# EasyEDA schematic SCH_DA2_fix_2023-07-17.json
TITLE: Mq135; REV: 1.0; Date: 2023-06-28; Sheet: 1/1; Company: Your Company
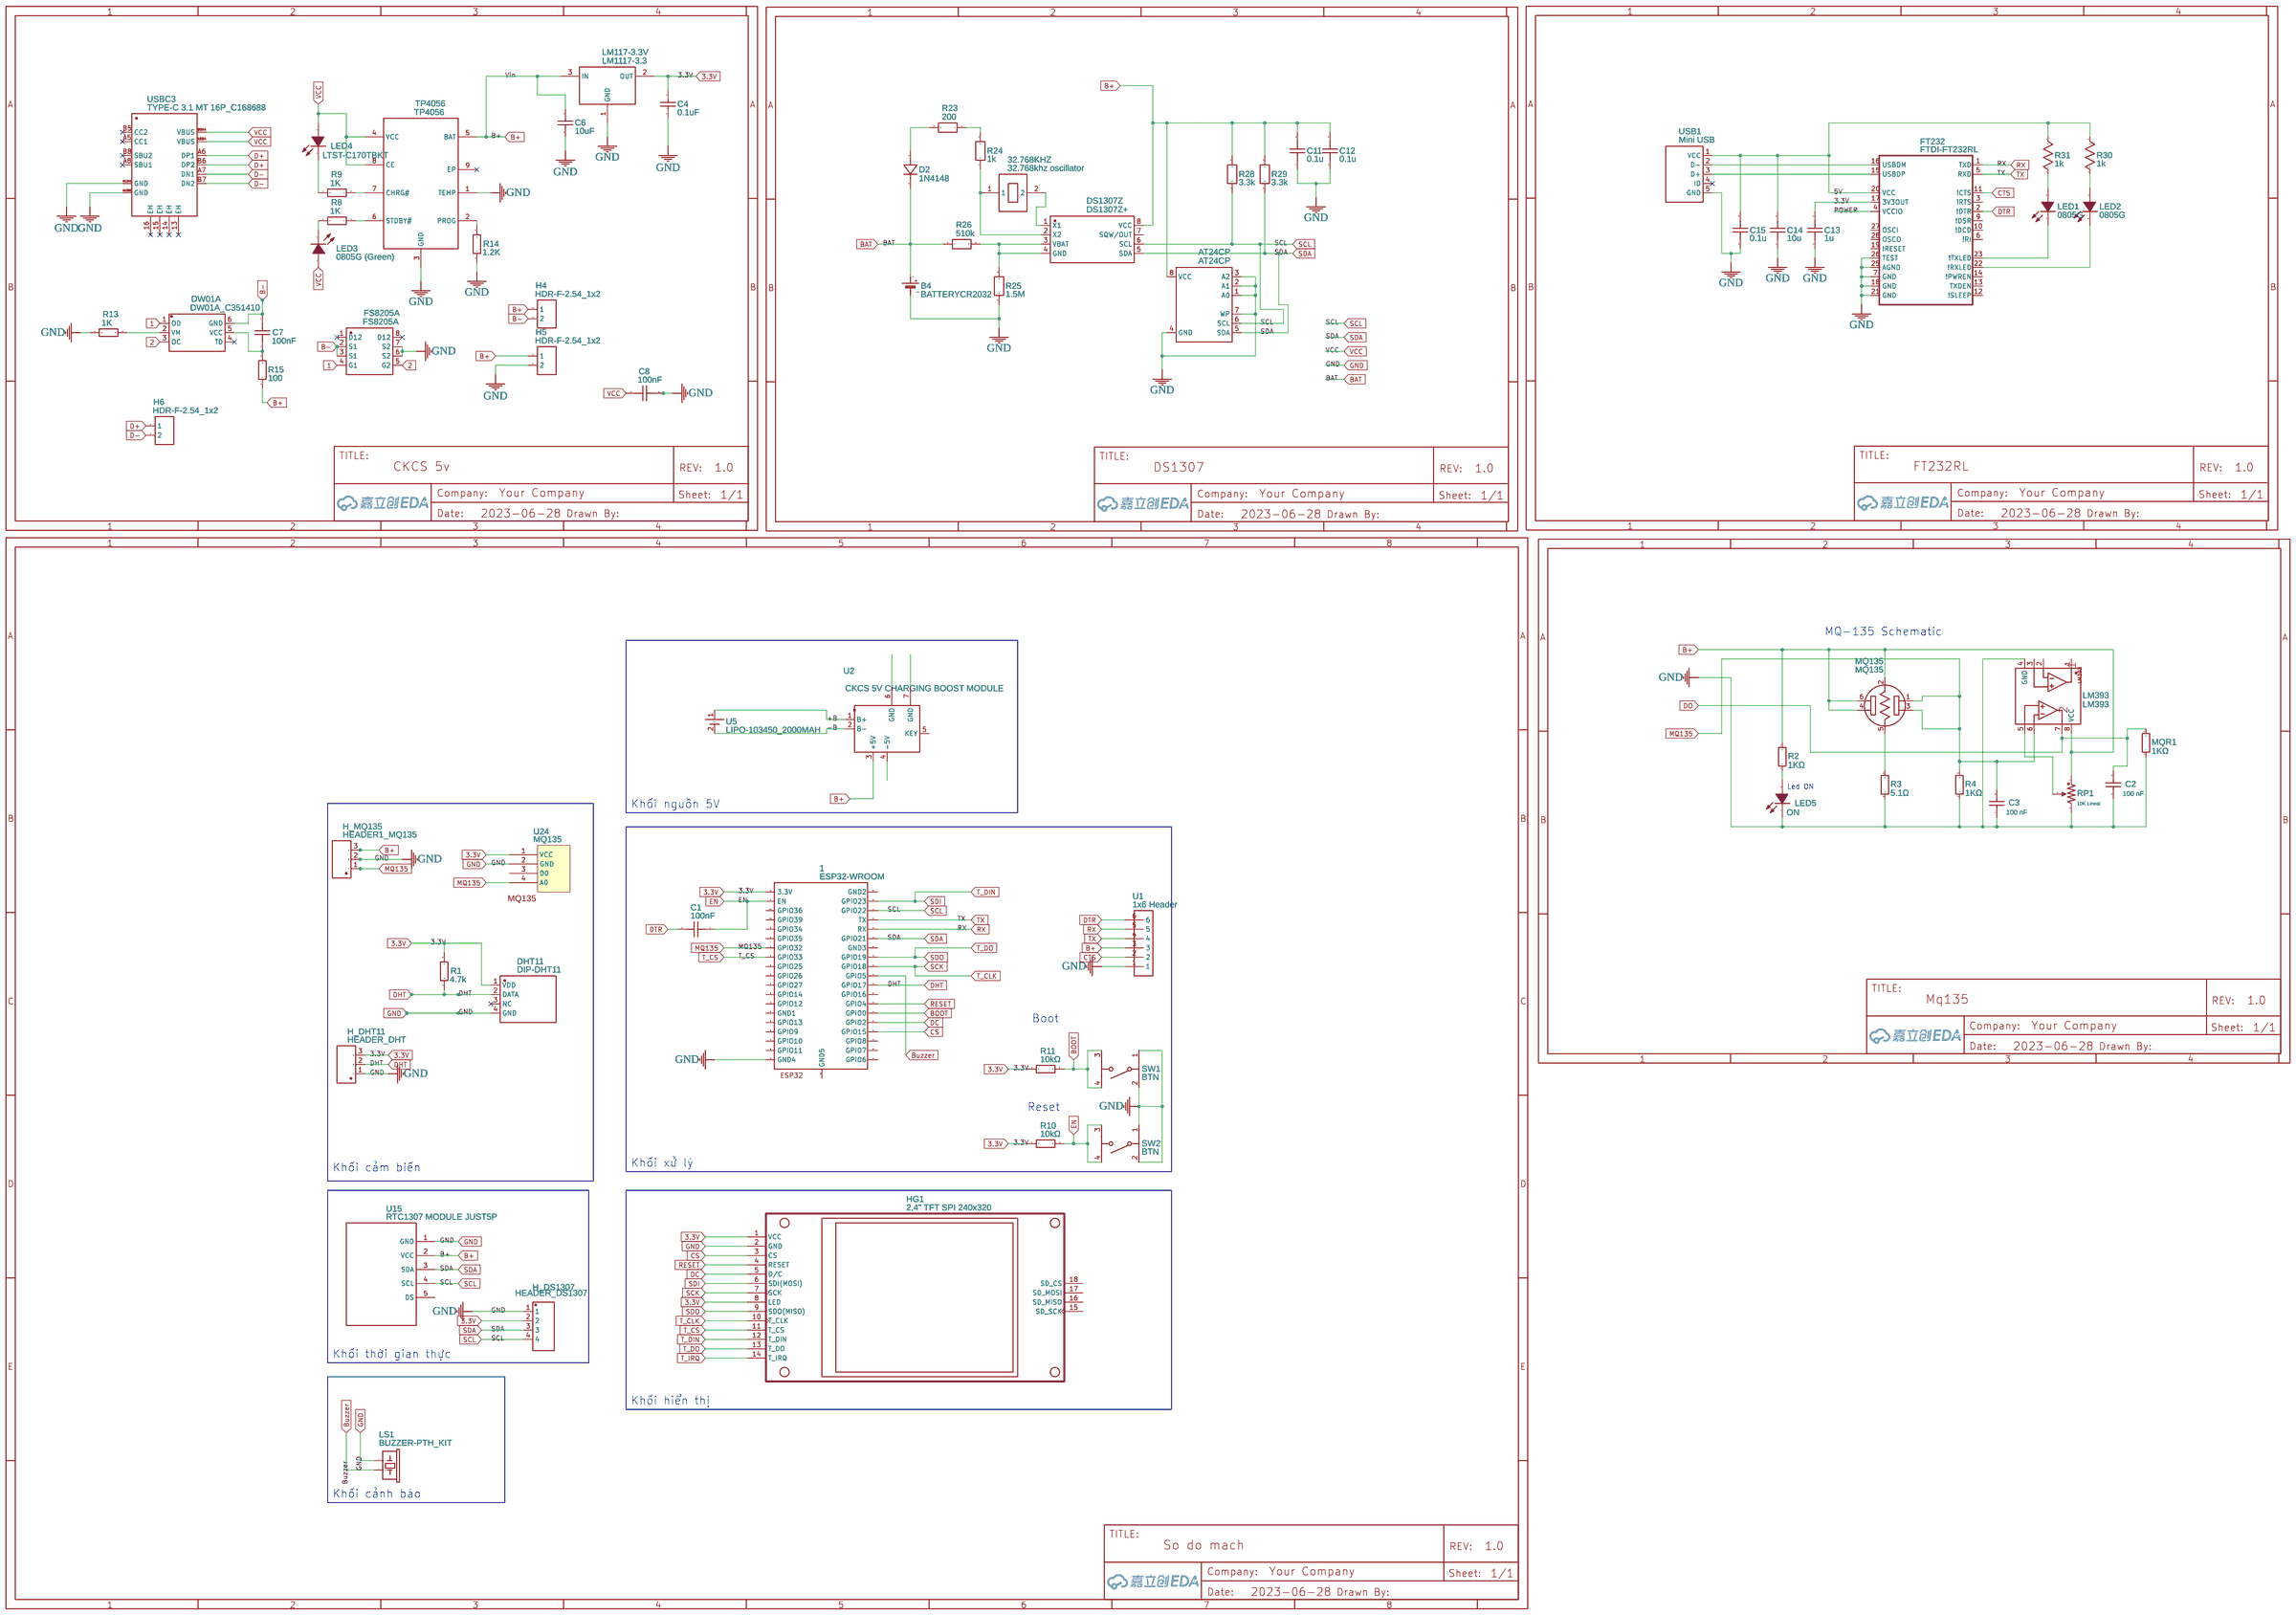
[diagram p0: schematic sheet]

## Parts
1  ESP32-WROOM  [ESP32-WROOM]
32.768KHZ  32.768khz oscillator  [32.768KHZ OSCILLATOR]
AT24CP  AT24CP  [DIL08]
B4  BATTERYCR2032  [CR2032_4U_15728]
C1  100nF  [C0805]
C2  100 nF  [C0805]
C3  100 nF  [C0805]
C4  0.1uF  [C0805]
C6  10uF  [C0805]
C7  100nF  [C0805]
C8  100nF  [C0805]
C11  0.1u  [C0805]
C12  0.1u  [C0805]
C13  1u  [C0805]
C14  10u  [C0805]
C15  0.1u  [C0805]
D2  1N4148  [SOD-323_L1.6-W1.3-LS2.7-RD]
DHT11  DIP-DHT11  [DIP-DHT11]
DS1307Z  DS1307Z+  [SOIC-8_L5.0-W4.0-P1.27-LS6.0-BL]
DW01A  DW01A_C351410  [SOT-23-6_L2.9-W1.6-P0.95-LS2.8-BL]
FS8205A  FS8205A  [TSSOP-8_L4.4-W3.0-P0.65-LS6.4-BL-2]
FT232  FTDI-FT232RL  [SSOP28]
H4  HDR-F-2.54_1x2  [HDR-F-2.54_1X2]
H5  HDR-F-2.54_1x2  [HDR-F-2.54_1X2]
H6  HDR-F-2.54_1x2  [HDR-F-2.54_1X2]
H_DHT11  HEADER_DHT  [HEADER1X3]
H_DS1307  HEADER_DS1307  [HEADER - HEADER-FEMALE-2.54_1X4]
H_MQ135  HEADER1_MQ135  [HEADER1X3]
HG1  2,4" TFT SPI 240x320  [2.4_TFT_TS]
LED1  0805G  [LED0805-RD_GREEN]
LED2  0805G  [LED0805-RD_GREEN]
LED3  0805G (Green)  [LED0805-RD_GREEN]
LED4  LTST-C170TBKT  [LED0805-RD_BLUE]
LED5  ON  [LED0805-RD_BLUE]
LM117-3.3V  LM1117-3.3  [LM1117-3.3 UP]
LM393  LM393  [MSOP-8_L3.0-W3.0-P0.65-LS5.0-BL]
LS1  BUZZER-PTH_KIT  [BUZZER-12MM-KIT]
MQ135  MQ135  [MQ135_METAL_CAP]
MQR1  1KΩ  [R0805]
R1  4.7k  [R0805]
R2  1KΩ  [R0805]
R3  5.1Ω  [R0805]
R4  1KΩ  [R0805]
R8  1K  [R0805]
R9  1K  [R0805]
R10  10kΩ  [R0805]
R11  10kΩ  [R0805]
R13  1K  [R0805]
R14  1.2K  [R0805]
R15  100  [R0805]
R23  200  [R0805]
R24  1k  [R0805]
R25  1.5M  [R0805]
R26  510k  [R0805]
R28  3.3k  [R0805]
R29  3.3k  [R0805]
R30  1k  [R0805]
R31  1k  [R0805]
RP1  10K Lineal  [RES-ADJ-TH_3386P]
SW1  BTN  [SW-TH_4P-L6.0-W6.0-P4.50-LS6.1]
SW2  BTN  [SW-TH_4P-L6.0-W6.0-P4.50-LS6.1]
TP4056  TP4056  [ESOP-8_L4.9-W3.9-P1.27-LS6.0-BL-EP]
U1  1x6 Header  [1X6 HEADER]
U2  CKCS 5V CHARGING BOOST MODULE  [CKCS 5V CHARGING MODULE]
U5  LIPO-103450_2000MAH  [LIPO-103450_2000MAH]
U15  RTC1307 MODULE JUST5P  [RTC1307 MODULE]
U24  MQ135  [MQ135]
USB1  Mini USB  [MINI-USB-SMD_MINI-5PTP]
USBC3  TYPE-C 3.1 MT 16P_C168688  [USB-C-SMD_TYPE-C-USB-4]

## Library data of the parts
1 = ESP32-WROOM: Contributor: eagleone
32.768KHZ = 32.768khz oscillator: Contributor: pattykarigi96
AT24CP = AT24CP: 2-wire serial EEPROM
B4 = BATTERYCR2032: Contributor: farmerjoe0606
C1 C7 C8 = C0805B104M500NT: Supplier: LCSC; Supplier Part: C515949; Manufacturer: 火炬; Contributor: LCSC; JLCPCB Part Class: Extended Part
C2 C3 = Cap.: Supplier: LCSC; Manufacturer: LCSC; Manufacturer Part: 0.1UF(104) +-20% 63v; Supplier Part: C19355; Contributor: Educaporale
C4 C6 = CC0805KKX5R6BB106: Supplier: LCSC; Manufacturer: YAGEO; Supplier Part: C89832; JLCPCB Part Class: Extended Part
C11 C12 = C_0603_US: Contributor: LCEDA_Lib
C13-C15 = Cap_1206_US: Manufacturer Part: ?
D2 = 1N4148WSG_C2904852: Supplier: LCSC; Supplier Part: C2904852; Manufacturer: SHIKUES(时科); Manufacturer Part: 1N4148WSG; JLCPCB Part Class: Extended Part; Contributor: lcsc
DHT11 = DIP-DHT11: Supplier: LCSC; Manufacturer: AOSONG; Contributor: LCSC; Supplier Part: C117051
DS1307Z = DS1307Z+: Supplier: LCSC; Supplier Part: C1520446; Manufacturer: MAXIM(美信); Contributor: LCSC; JLCPCB Part Class: Extended Part
DW01A = DW01A_C351410: Supplier: LCSC; Supplier Part: C351410; Manufacturer: PUOLOP; Contributor: LCSC; JLCPCB Part Class: Extended Part
FS8205A = FS8205A: Supplier: LCSC; Manufacturer: FORTUNE; Supplier Part: C16052; JLCPCB Part Class: Basic Part
FT232 = -: Contributor: mrsunny; Manufacturer Part: ?
H4-H6 = HDR-F-2.54_1x2: Supplier Part: C49661; Supplier: LCSC; Contributor: LCEDA_Lib
H_DHT11 = HEADER1X3: Contributor: Nathan Milligan
H_DS1307 = HEADER 1X4P COPY COPY: Contributor: trananhkha2406; Supplier: Sparkfun
H_MQ135 = HEADER1X3: Contributor: Nathan Milligan; Package Display: No
HG1 = 2,4&amp;quot; TFT SPI 240x320: Manufacturer Part: 2,4" TFT SPI; Contributor: IgnatiusF
LED1-LED3 = 0805G (Green): Supplier: LCSC; Manufacturer: KENTO; Supplier Part: C2297; JLCPCB Part Class: Basic Part
LED4 LED5 = LTST-C170TBKT: Supplier: LCSC; Manufacturer: LITEON; Contributor: LCSC; Supplier Part: C98222
LM117-3.3V = LM1117-3.3: Contributor: dimitr_dm
LM393 = LM393: Supplier: LCSC; Supplier Part: C231851; Manufacturer: ON Semicon; Manufacturer Part: LM393DMR2G; Contributor: Educaporale
LS1 = BUZZER-PTH_KIT: Contributor: tech download
MQ135 = MQ135: Manufacturer: Zhengzhou Winsen Electronics Technology Co., Ltd; Contributor: Tony Marín Cerezuela; Package Display: No
MQR1 R2-R4 = R_1/4_AXIAL-0.4: Supplier Part: C61297; Supplier: Educaporale; Manufacturer Part: CFR0W4J0472A50; Manufacturer: UniOhm; Contributor: Educaporale; Tolerancia: 5%; Power: 1/4W
R1 R14 = RMC06031.2K5%N: Supplier: LCSC; Supplier Part: C269681; Manufacturer: Tyohm; Contributor: LCSC; JLCPCB Part Class: Extended Part
R8 R9 R13 = AECR0603F1K00K9: Supplier: LCSC; Supplier Part: C328340; Manufacturer: ResistorToday; Contributor: LCSC; JLCPCB Part Class: Extended Part
R10 R11 = PTFR1206B10K0P9: Supplier: LCSC; Supplier Part: C351536; Manufacturer: ResistorToday; Contributor: LCSC; Resistance (Ohms): 10K; JLCPCB Part Class: Extended Part
R15 = AECR0603F100RK9: Supplier: LCSC; Supplier Part: C328334; Manufacturer: ResistorToday; Contributor: LCSC; JLCPCB Part Class: Extended Part
R23-R26 R28 R29 = R_0603_EU: Contributor: LCEDA_Lib
R30 R31 = Res_1206(1/4W)_US: Manufacturer Part: ?
RP1 = R_3386P_US: Supplier: LCSC; Contributor: LCEDA_Lib; value(Ω): 10K
SW1 SW2 = Button-6x6x6mm: Supplier Part: C71836; Supplier: LCSC; Manufacturer: BBJ; Manufacturer Part: Switch,6*6*6Plastic head,260G, 0.25mm,Straight line
TP4056 = TP4056: Contributor: Guest; Supplier: LCSC; Manufacturer: TOPPOWER; Supplier Part: C16581; JLCPCB Part Class: Basic Part
U1 = 1x6 Header: Contributor: iinnovations
U2 = CKCS 5V CHARGING BOOST MODULE: Supplier: DYKBmetered; link: https://www.aliexpress.com/item/1005001428397158.html?spm=a2g0s.9042311.0.0.17b44c4d9Ls686; Contributor: odorica
U5 = LIPO-103450_2000MAH: link: https://www.myarduino.net/product/2675/%E0%B9%81%E0%B8%9A%E0%B8%95%E0%B9%80%E0%B8%95%E0%B8%AD%E0%B8%A3%E0%B8%B5%E0%B9%88-%E0%B8%A5%E0%B8%B5%E0%B9%80%E0%B8%98%E0%B8%B5%E0%B9%88%E0%B8%A2%E0%B8%A1%E0%B9%82%E0%B8%9E%E0%B8%A5%E0%B8%B4%E0%B9%80%E0%B8%A1%E0%B8%AD%E0%B8%A3%E0%B9%8C-3-7v-%E0%B8%84%E0%B8%A7%E0%B8%B2%E0%B8%A1%E0%B8%88%E0%B8%B8-2000mah-103450-lithium-polymer-battery; Contributor: MEBenz
U15 = RTC1307 MODULE JUST5P: link: https://www.openhacks.com/uploadsproductos/tiny_rtc_-_elecrow.pdf; Contributor: Abdul Muis
U24 = MQ135: Contributor: 김형수; Package Display: Yes
USB1 = Mini USB: Contributor: Филипп Восоль
USBC3 = TYPE-C 3.1 MT 16P_C168688: Supplier: LCSC; Supplier Part: C168688; Manufacturer: LCSC; Contributor: Аксултан Кадыр; JLCPCB Part Class: Extended Part

## Nets
3.3V: 1.3V3(3.3V) C4.1 C13.2 DHT11.1(VDD) FT232.17(3V3OUT) H_DHT11.3 H_DS1307.2 HG1.1(VCC) HG1.8(LED) LM117-3.3V.2(OUT) R1.2 R10.1 R11.1 U24.1(VCC)
5V: C14.2 C15.2 FT232.20(VCC) R30.2 R31.2 USB1.1(VCC)
GND: 1.GND4 AT24CP.1(A0) AT24CP.2(A1) AT24CP.3(A2) AT24CP.4(GND) AT24CP.7(WP) B4.- C2.1 C3.1 C4.2 C6.2 C8.2 C11.1 C12.1 C13.1 C14.1 C15.1 DHT11.4(GND) FS8205A.6(S2) FS8205A.7(S2) FT232.7(GND) FT232.18(GND) FT232.21(GND) FT232.25(AGND) FT232.26(TEST) H5.2 H_DHT11.1 H_DS1307.1 H_MQ135.2 HG1.2(GND) LED5.1(K) LM117-3.3V.1(GND) LM393.4(GND) LS1.+(1) MQR1.1 R3.1 R4.1 R13.1 R14.1 R25.1 RP1.3 SW1.1 SW1.2 SW2.1 SW2.2 TP4056.1(TEMP) TP4056.3(GND) U1.1 U15.1(GND) U24.2(GND) USB1.5(GND) USBC3.A12B1(GND) USBC3.B12A1(GND)
VCC: C8.1 LED3.2(A) LED4.2(A) TP4056.4(VCC) TP4056.8(CE) USBC3.A9B4(VBUS) USBC3.B9A4(VBUS)
1: DW01A.1(OD) FS8205A.4(G1)
2: DW01A.3(OC) FS8205A.5(G2)
+B: U2.1(B+) U5.1(POS)
-B: U2.2(B-) U5.2(POS)
B+: AT24CP.8(VCC) C6.1 C11.2 C12.2 DS1307Z.8(VCC) H4.1 H5.1 H_MQ135.3 LM117-3.3V.3(IN) LM393.8(VCC) MQ135.2(H) MQ135.4 MQ135.6 R2.2 R15.1 R28.2 R29.2 RP1.1 TP4056.5(BAT) U1.3 U2.3(+5V) U15.2(VCC)
B-: C7.2 DW01A.6(GND) FS8205A.2(S1) FS8205A.3(S1) H4.2
BAT: B4.+ D2.1(K) R26.1
BOOT: 1.IO0(GPIO0) R11.2 SW1.3 SW1.4
Buzzer: 1.IO5(GPIO5) LS1.-(2)
CS: 1.IO15(GPIO15) HG1.3(CS)
CTS: FT232.11(!CTS) U1.2
D+: H6.1 USBC3.A6(DP1) USBC3.B6(DP2)
D-: H6.2 USBC3.A7(DN1) USBC3.B7(DN2)
DC: 1.IO2(GPIO2) HG1.5(D/C)
DHT: 1.IO17(GPIO17) DHT11.2(DATA) H_DHT11.2 R1.1
DO: C2.2 LM393.7 MQR1.2
DTR: C1.2 FT232.2(!DTR) U1.6
EN: 1.EN C1.1 R10.2 SW2.3 SW2.4
MQ135: 1.IO32(GPIO32) C3.2 H_MQ135.1 LM393.6 MQ135.1 MQ135.3 R4.2 U24.4(A0)
POWER: FT232.4(VCCIO)
RESET: 1.IO4(GPIO4) HG1.4(RESET)
RX: 1.RX FT232.1(TXD) U1.5
SCK: 1.IO18(GPIO18) HG1.7(SCK) HG1.10(T_CLK)
SCL: 1.IO22(GPIO22) AT24CP.6(SCL) DS1307Z.6(SCL) H_DS1307.4 R28.1 U15.4(SCL)
SDA: 1.IO21(GPIO21) AT24CP.5(SDA) DS1307Z.5(SDA) H_DS1307.3 R29.1 U15.3(SDA)
SDI: 1.IO23(GPIO23) HG1.6(SDI(MOSI)) HG1.12(T_DIN)
SDO: 1.IO19(GPIO19) HG1.9(SDO(MISO)) HG1.13(T_DO)
T_CS: 1.IO33(GPIO33) HG1.11(T_CS)
T_IRQ: HG1.14(T_IRQ)
TX: 1.TX FT232.5(RXD) U1.4
Net-(32.768KHZ-1): 32.768KHZ.1 DS1307Z.2(X2) R24.1
Net-(32.768KHZ-2): 32.768KHZ.2 DS1307Z.1(X1)
Net-(C7-1): C7.1 DW01A.5(VCC) R15.2
Net-(D2-2): D2.2(A) R23.2
Net-(DS1307Z-3): DS1307Z.3(VBAT) DS1307Z.4(GND) R25.2 R26.2
Net-(DW01A-2): DW01A.2(VM) R13.2
Net-(FT232-15): FT232.15(USBDP) USB1.3(D+)
Net-(FT232-16): FT232.16(USBDM) USB1.2(D-)
Net-(FT232-22): FT232.22(!RXLED) LED2.1(K)
Net-(FT232-23): FT232.23(!TXLED) LED1.1(K)
Net-(LED1-2): LED1.2(A) R31.1
Net-(LED2-2): LED2.2(A) R30.1
Net-(LED3-1): LED3.1(K) R8.1
Net-(LED4-1): LED4.1(K) R9.1
Net-(LED5-2): LED5.2(A) R2.1
Net-(LM393-5): LM393.5 RP1.2
Net-(MQ135-5): MQ135.5(H) R3.2
Net-(R8-2): R8.2 TP4056.6(STDBY#)
Net-(R9-2): R9.2 TP4056.7(CHRG#)
Net-(R14-2): R14.2 TP4056.2(PROG)
Net-(R23-1): R23.1 R24.2

Not connected (* = marked no-connect by the designer): 1 CLK(GPIO6) CMD(GPIO11) GND1 GND2 GND3 GND5 IO12(GPIO12) IO13(GPIO13) IO14(GPIO14) IO16(GPIO16) IO25(GPIO25) IO26(GPIO26) IO27(GPIO27) IO34(GPIO34) IO35(GPIO35) SD0(GPIO7) SD1(GPIO8) SD2(GPIO9) SD3(GPIO10) SENSOR_VN(GPIO39) SENSOR_VP(GPIO36); DHT11 3(NC)*; DS1307Z 7(SQW/OUT); DW01A 4(TD)*; FS8205A 1(D12)* 8(D12)*; FT232 3(!RTS) 6(!RI) 9(!DSR) 10(!DCD) 12(!SLEEP) 13(TXDEN) 14(!PWREN) 19(!RESET) 27(OSCI) 28(OSCO); HG1 15(SD_SCK) 16(SD_MISO) 17(SD_MOSI) 18(SD_CS); LM393 1(OUT 1) 2(IN1-) 3; TP4056 9(EP)*; U2 4(-5V) 5(KEY) 6(GND) 7(GND); U15 5(DS); U24 3(D0); USB1 4(ID)*; USBC3 13(EH)* 14(EH)* 15(EH)* 16(EH)* A5(CC1)* A8(SBU1)* B5(CC2)* B8(SBU2)*

## Notes on the sheet
- MQ-135 Schematic
- Led ON
- Khối nguồn 5V
- Boot
- Reset
- Khối cảm biến
- Khối xử lý
- Khối thời gian thực
- Khối hiển thị
- Khối cảnh báo
